# Altium schematic sheet H_bridge.SchDoc
size A4
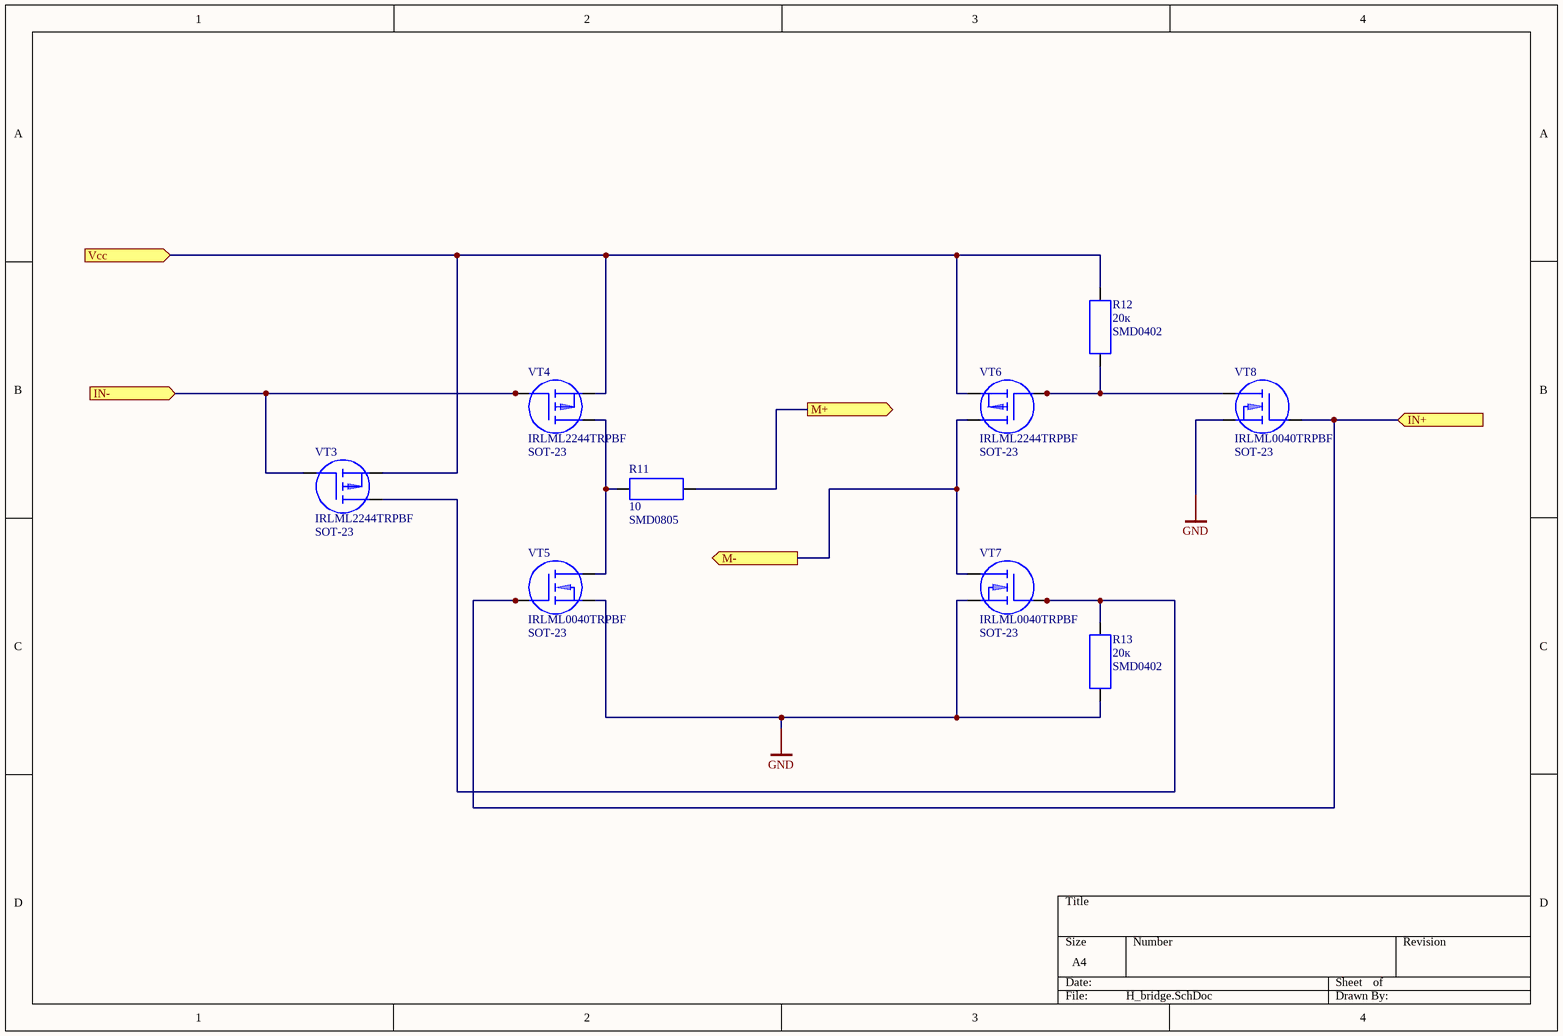
[diagram p0: H_bridge.SchDoc]

## Parts
R11  10  Package: SMD0805  [SMD0805(2012)]
R12  20к  Package: SMD0402  [SMD0402(1608)]
R13  20к  Package: SMD0402  [SMD0402(1608)]
VT3  IRLML2244TRPBF  Package: SOT-23  [SOT23-3]
VT4  IRLML2244TRPBF  Package: SOT-23  [SOT23-3]
VT5  IRLML0040TRPBF  Package: SOT-23  [SOT23-3]
VT6  IRLML2244TRPBF  Package: SOT-23  [SOT23-3]
VT7  IRLML0040TRPBF  Package: SOT-23  [SOT23-3]
VT8  IRLML0040TRPBF  Package: SOT-23  [SOT23-3]

## Ports
IN+ (in), IN- (in), M+ (out), M- (out), Vcc (in)

## Nets
GND: R13.2 VT5.2 VT7.2 VT8.2
IN+: VT5.1 VT8.1 ; port IN+
IN-: VT3.1 VT4.1 ; port IN-
M+: R11.1 ; port M+
M-: VT6.3 VT7.3 ; port M-
Vcc: R12.1 VT3.2 VT4.2 VT6.2 ; port Vcc
NetR11_2: R11.2 VT4.3 VT5.3
NetR12_2: R12.2 VT6.1 VT8.3
NetR13_1: R13.1 VT3.3 VT7.1

## Library data of the parts
R11 = R_0805: ValueBOM: Резистор 10 Ом SMD 0805 1%; Type: R; Value: 10
R12 R13 = R_0402: ValueBOM: Резистор 20кОм SMD 0402 1%; Type: R; Value: 20к
VT3 VT4 VT6 = VT_P_MOSFET_SOT23_3: Type: VT; ValueBOM: Транзистор p-МОП IRLML2244TRPBF SOT23; Value: IRLML2244TRPBF
VT5 VT7 VT8 = VT_N_MOSFET_SOT23_3: Type: VT; ValueBOM: Транзистор n-МОП IRLML0040TRPBF SOT23; Value: IRLML0040TRPBF